# Altium project BlazePodMaster.PrjPcb
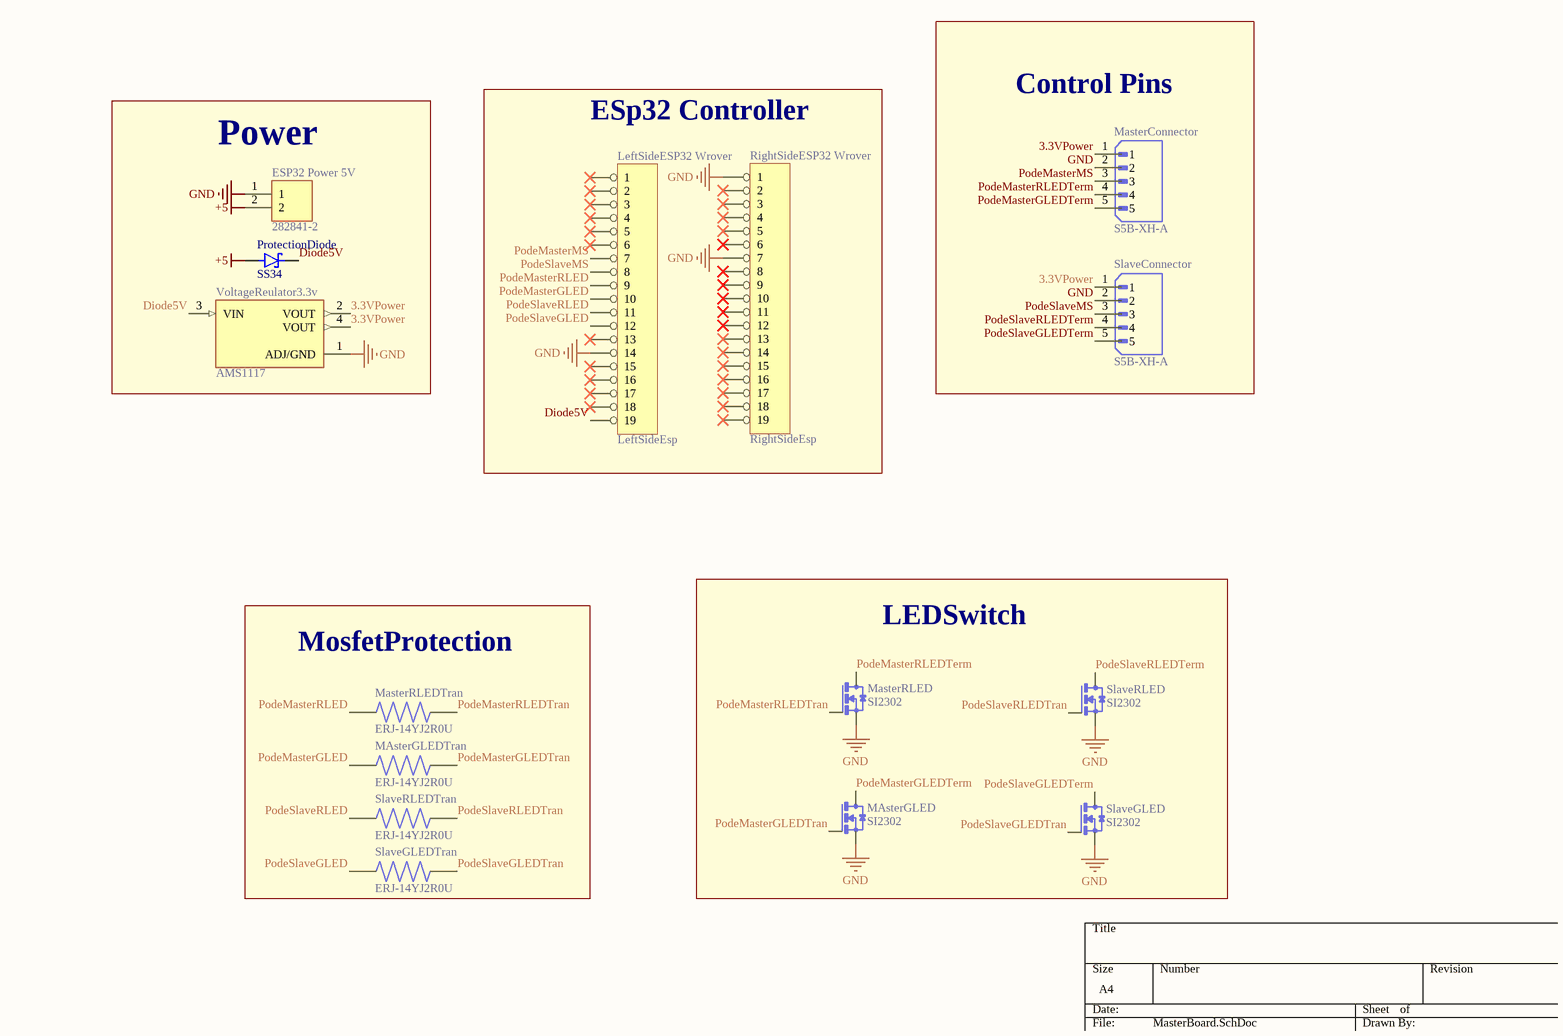
[diagram p0: MasterBoard.SchDoc]
1 sheet, 15 parts. Net scope: global (net labels, ports and power ports of the same name join across sheets).
Board file: MasterBoard.PcbDoc

## Sheet MasterBoard.SchDoc
size A4

### Parts
ESP32_Power_5V  282841-2  [TE_282841-2]
LeftSideESP32_Wrover  LeftSideEsp  [SIP19]
MasterConnector  S5B-XH-A  [JST_S5B-XH-A]
MAsterGLED  SI2302  [SOT23]
MAsterGLEDTran  ERJ-14YJ2R0U  [RESC3225X70N]
MasterRLED  SI2302  [SOT23]
MasterRLEDTran  ERJ-14YJ2R0U  [RESC3225X70N]
ProtectionDiode  SS34  [DIO_SS34]
RightSideESP32_Wrover  RightSideEsp  [SIP19]
SlaveConnector  S5B-XH-A  [JST_S5B-XH-A]
SlaveGLED  SI2302  [SOT23]
SlaveGLEDTran  ERJ-14YJ2R0U  [RESC3225X70N]
SlaveRLED  SI2302  [SOT23]
SlaveRLEDTran  ERJ-14YJ2R0U  [RESC3225X70N]
VoltageReulator3.3v  AMS1117  [SOT229P700X180-4N]

### Blocks framed on the sheet
Control Pins: MasterConnector SlaveConnector
Power: ESP32_Power_5V ProtectionDiode VoltageReulator3.3v
ESp32 Controller: LeftSideESP32_Wrover RightSideESP32_Wrover
MosfetProtection: MAsterGLEDTran MasterRLEDTran SlaveGLEDTran SlaveRLEDTran
LEDSwitch: MAsterGLED MasterRLED SlaveGLED SlaveRLED

### Nets
+5: ESP32_Power_5V.2 ProtectionDiode.A
GND: ESP32_Power_5V.1 LeftSideESP32_Wrover.14 MasterConnector.2 MAsterGLED.2(S) MasterRLED.2(S) RightSideESP32_Wrover.1 RightSideESP32_Wrover.7 SlaveConnector.2 SlaveGLED.2(S) SlaveRLED.2(S) VoltageReulator3.3v.1(ADJ/GND)
3.3VPower: MasterConnector.1 SlaveConnector.1 VoltageReulator3.3v.2(VOUT) VoltageReulator3.3v.4(VOUT)
Diode5V: LeftSideESP32_Wrover.19 ProtectionDiode.C(K) VoltageReulator3.3v.3(VIN)
PodeMasterGLED: LeftSideESP32_Wrover.10 MAsterGLEDTran.1
PodeMasterGLEDTerm: MasterConnector.5 MAsterGLED.3(D)
PodeMasterGLEDTran: MAsterGLED.1(G) MAsterGLEDTran.2
PodeMasterMS: LeftSideESP32_Wrover.7 MasterConnector.3
PodeMasterRLED: LeftSideESP32_Wrover.9 MasterRLEDTran.1
PodeMasterRLEDTerm: MasterConnector.4 MasterRLED.3(D)
PodeMasterRLEDTran: MasterRLED.1(G) MasterRLEDTran.2
PodeSlaveGLED: LeftSideESP32_Wrover.12 SlaveGLEDTran.1
PodeSlaveGLEDTerm: SlaveConnector.5 SlaveGLED.3(D)
PodeSlaveGLEDTran: SlaveGLED.1(G) SlaveGLEDTran.2
PodeSlaveMS: LeftSideESP32_Wrover.8 SlaveConnector.3
PodeSlaveRLED: LeftSideESP32_Wrover.11 SlaveRLEDTran.1
PodeSlaveRLEDTerm: SlaveConnector.4 SlaveRLED.3(D)
PodeSlaveRLEDTran: SlaveRLED.1(G) SlaveRLEDTran.2

Not connected (* = marked no-connect by the designer): LeftSideESP32_Wrover 1* 2* 3* 4* 5* 6* 13* 15* 16* 17* 18*; RightSideESP32_Wrover 2* 3* 4* 5* 6* 8* 9* 10* 11* 12* 13* 14* 15* 16* 17* 18* 19*

### Library data of the parts
ESP32_Power_5V = 282841-2: TERM BLOCK 2POS SIDE ENT 5.08MM; MF: {'manufacturer': u'TE Connectivity'}; Value: *; Price: None; Availability: Unavailable; Package: None; MP: 282841-2
LeftSideESP32_Wrover RightSideESP32_Wrover = HEADER 19
MasterConnector SlaveConnector = S5B-XH-A: MF: {'manufacturer': u'JST'}; Package: None; Price: None; Value: *; MP: S5B-XH-A; Availability: Unavailable
MAsterGLED MasterRLED SlaveGLED SlaveRLED = SI2302: MOSFET N-Channel 20 V (D-S); MF: {'manufacturer': u'Vishay Siliconix'}; Package: None; Price: None; Value: *; MP: SI2302; Availability: Unavailable
MAsterGLEDTran MasterRLEDTran SlaveGLEDTran SlaveRLEDTran = ERJ-14YJ2R0U: THICK FILM RESISTOR, 1210, 2OHM, 5%, 500mW; MF: {'manufacturer': u'Panasonic'}; Package: None; Price: None; Value: *; MP: ERJ-14YJ2R0U; Availability: Unavailable
ProtectionDiode = SS34: MF: {'manufacturer': u'Taiwan Semiconductor'}; Package: None; Price: None; Value: *; MP: SS34; Availability: Unavailable
VoltageReulator3.3v = AMS1117: Sot223/Pkg 1-Amp 5-Volt Low Drop Out Voltage Regulatator; MF: {'manufacturer': u'Advanced Monolithic Systems'}; Package: None; Price: None; Value: *; MP: AMS1117; Availability: Unavailable